# EAGLE design Breakout_05_08 (EAGLE 9.6.2)
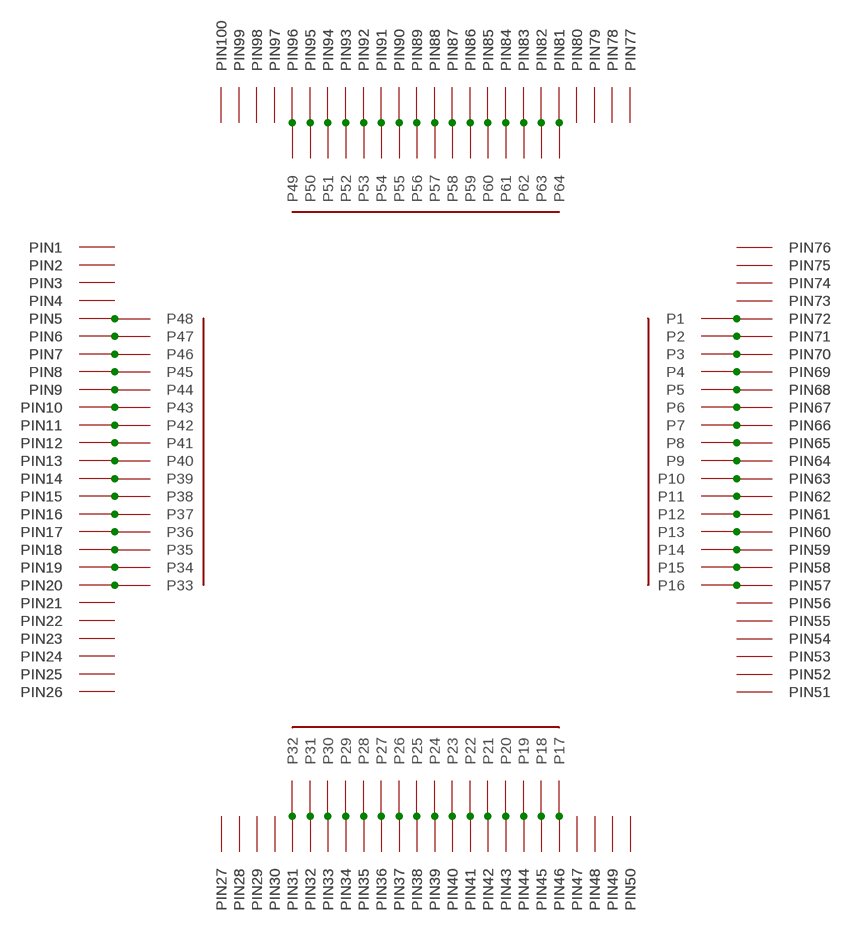
[diagram p0: schematic, sheet 1]

## Parts
U$1  OUTTER_PADS_100PIN  [TQFP_100_PIN_DIN]
U$2  SMT_64PIN_R  [TQFP_SMT_08MM]
U$3  SMT_100PIN  [TQFP_SMT_05MM]

## Nets
N$1: U$1.P$157(PIN57) U$2.P$16(P16) U$3.P$57(PIN57)
N$2: U$1.P$158(PIN58) U$2.P$15(P15) U$3.P$58(PIN58)
N$3: U$1.P$159(PIN59) U$2.P$14(P14) U$3.P$59(PIN59)
N$4: U$1.P$160(PIN60) U$2.P$13(P13) U$3.P$60(PIN60)
N$5: U$1.P$161(PIN61) U$2.P$12(P12) U$3.P$61(PIN61)
N$6: U$1.P$162(PIN62) U$2.P$11(P11) U$3.P$62(PIN62)
N$7: U$1.P$163(PIN63) U$2.P$10(P10) U$3.P$63(PIN63)
N$8: U$1.P$164(PIN64) U$2.P$9(P9) U$3.P$64(PIN64)
N$9: U$1.P$165(PIN65) U$2.P$8(P8) U$3.P$65(PIN65)
N$10: U$1.P$166(PIN66) U$2.P$7(P7) U$3.P$66(PIN66)
N$11: U$1.P$167(PIN67) U$2.P$6(P6) U$3.P$67(PIN67)
N$12: U$1.P$168(PIN68) U$2.P$5(P5) U$3.P$68(PIN68)
N$13: U$1.P$169(PIN69) U$2.P$4(P4) U$3.P$69(PIN69)
N$14: U$1.P$170(PIN70) U$2.P$3(P3) U$3.P$70(PIN70)
N$15: U$1.P$171(PIN71) U$2.P$2(P2) U$3.P$71(PIN71)
N$16: U$1.P$172(PIN72) U$2.P$1(P1) U$3.P$72(PIN72)
N$17: U$1.P$146(PIN46) U$2.P$17(P17) U$3.P$46(PIN46)
N$18: U$1.P$145(PIN45) U$2.P$18(P18) U$3.P$45(PIN45)
N$19: U$1.P$144(PIN44) U$2.P$19(P19) U$3.P$44(PIN44)
N$20: U$1.P$143(PIN43) U$2.P$20(P20) U$3.P$43(PIN43)
N$21: U$1.P$142(PIN42) U$2.P$21(P21) U$3.P$42(PIN42)
N$22: U$1.P$141(PIN41) U$2.P$22(P22) U$3.P$41(PIN41)
N$23: U$1.P$140(PIN40) U$2.P$23(P23) U$3.P$40(PIN40)
N$24: U$1.P$139(PIN39) U$2.P$24(P24) U$3.P$39(PIN39)
N$25: U$1.P$138(PIN38) U$2.P$25(P25) U$3.P$38(PIN38)
N$26: U$1.P$137(PIN37) U$2.P$27(P26) U$3.P$37(PIN37)
N$27: U$1.P$136(PIN36) U$2.P$28(P27) U$3.P$36(PIN36)
N$28: U$1.P$135(PIN35) U$2.P$29(P28) U$3.P$35(PIN35)
N$29: U$1.P$134(PIN34) U$2.P$30(P29) U$3.P$34(PIN34)
N$30: U$1.P$133(PIN33) U$2.P$31(P30) U$3.P$33(PIN33)
N$31: U$1.P$132(PIN32) U$2.P$32(P31) U$3.P$32(PIN32)
N$32: U$1.P$131(PIN31) U$2.P$33(P32) U$3.P$31(PIN31)
N$33: U$1.P$120(PIN20) U$2.P$34(P33) U$3.P$20(PIN20)
N$34: U$1.P$119(PIN19) U$2.P$35(P34) U$3.P$19(PIN19)
N$35: U$1.P$118(PIN18) U$2.P$36(P35) U$3.P$18(PIN18)
N$36: U$1.P$117(PIN17) U$2.P$37(P36) U$3.P$17(PIN17)
N$37: U$1.P$116(PIN16) U$2.P$38(P37) U$3.P$16(PIN16)
N$38: U$1.P$115(PIN15) U$2.P$39(P38) U$3.P$15(PIN15)
N$39: U$1.P$114(PIN14) U$2.P$40(P39) U$3.P$14(PIN14)
N$40: U$1.P$113(PIN13) U$2.P$41(P40) U$3.P$13(PIN13)
N$41: U$1.P$112(PIN12) U$2.P$42(P41) U$3.P$12(PIN12)
N$42: U$1.P$111(PIN11) U$2.P$43(P42) U$3.P$11(PIN11)
N$43: U$1.P$110(PIN10) U$2.P$44(P43) U$3.P$10(PIN10)
N$44: U$1.P$109(PIN9) U$2.P$45(P44) U$3.P$9(PIN9)
N$45: U$1.P$108(PIN8) U$2.P$46(P45) U$3.P$8(PIN8)
N$46: U$1.P$107(PIN7) U$2.P$47(P46) U$3.P$7(PIN7)
N$47: U$1.P$106(PIN6) U$2.P$48(P47) U$3.P$6(PIN6)
N$48: U$1.P$105(PIN5) U$2.P$49(P48) U$3.P$5(PIN5)
N$49: U$1.P$196(PIN96) U$2.P$50(P49) U$3.P$96(PIN96)
N$50: U$1.P$195(PIN95) U$2.P$51(P50) U$3.P$95(PIN95)
N$51: U$1.P$194(PIN94) U$2.P$52(P51) U$3.P$94(PIN94)
N$52: U$1.P$193(PIN93) U$2.P$53(P52) U$3.P$93(PIN93)
N$53: U$1.P$192(PIN92) U$2.P$54(P53) U$3.P$92(PIN92)
N$54: U$1.P$191(PIN91) U$2.P$55(P54) U$3.P$91(PIN91)
N$55: U$1.P$190(PIN90) U$2.P$56(P55) U$3.P$90(PIN90)
N$56: U$1.P$189(PIN89) U$2.P$57(P56) U$3.P$89(PIN89)
N$57: U$1.P$188(PIN88) U$2.P$58(P57) U$3.P$88(PIN88)
N$58: U$1.P$187(PIN87) U$2.P$59(P58) U$3.P$87(PIN87)
N$59: U$1.P$186(PIN86) U$2.P$60(P59) U$3.P$86(PIN86)
N$60: U$1.P$185(PIN85) U$2.P$61(P60) U$3.P$85(PIN85)
N$61: U$1.P$184(PIN84) U$2.P$62(P61) U$3.P$84(PIN84)
N$62: U$1.P$183(PIN83) U$2.P$63(P62) U$3.P$83(PIN83)
N$63: U$1.P$182(PIN82) U$2.P$64(P63) U$3.P$82(PIN82)
N$64: U$1.P$181(PIN81) U$2.P$65(P64) U$3.P$81(PIN81)
N$65: U$1.P$101(PIN1) U$3.P$1(PIN1)
N$66: U$1.P$102(PIN2) U$3.P$2(PIN2)
N$67: U$1.P$103(PIN3) U$3.P$3(PIN3)
N$68: U$1.P$104(PIN4) U$3.P$4(PIN4)
N$69: U$1.P$121(PIN21) U$3.P$21(PIN21)
N$70: U$1.P$122(PIN22) U$3.P$22(PIN22)
N$71: U$1.P$123(PIN23) U$3.P$23(PIN23)
N$72: U$1.P$124(PIN24) U$3.P$24(PIN24)
N$73: U$1.P$125(PIN25) U$3.P$25(PIN25)
N$74: U$1.P$126(PIN26) U$3.P$26(PIN26)
N$75: U$1.P$127(PIN27) U$3.P$27(PIN27)
N$76: U$1.P$128(PIN28) U$3.P$28(PIN28)
N$77: U$1.P$129(PIN29) U$3.P$29(PIN29)
N$78: U$1.P$130(PIN30) U$3.P$30(PIN30)
N$79: U$1.P$147(PIN47) U$3.P$47(PIN47)
N$80: U$1.P$148(PIN48) U$3.P$48(PIN48)
N$81: U$1.P$149(PIN49) U$3.P$49(PIN49)
N$82: U$1.P$150(PIN50) U$3.P$50(PIN50)
N$83: U$1.P$151(PIN51) U$3.P$51(PIN51)
N$84: U$1.P$152(PIN52) U$3.P$52(PIN52)
N$85: U$1.P$153(PIN53) U$3.P$53(PIN53)
N$86: U$1.P$154(PIN54) U$3.P$54(PIN54)
N$87: U$1.P$155(PIN55) U$3.P$55(PIN55)
N$88: U$1.P$156(PIN56) U$3.P$56(PIN56)
N$89: U$1.P$173(PIN73) U$3.P$73(PIN73)
N$90: U$1.P$174(PIN74) U$3.P$74(PIN74)
N$91: U$1.P$175(PIN75) U$3.P$75(PIN75)
N$92: U$1.P$176(PIN76) U$3.P$76(PIN76)
N$93: U$1.P$177(PIN77) U$3.P$77(PIN77)
N$94: U$1.P$178(PIN78) U$3.P$78(PIN78)
N$95: U$1.P$179(PIN79) U$3.P$79(PIN79)
N$96: U$1.P$180(PIN80) U$3.P$80(PIN80)
N$97: U$1.P$197(PIN97) U$3.P$97(PIN97)
N$98: U$1.P$198(PIN98) U$3.P$98(PIN98)
N$99: U$1.P$199(PIN99) U$3.P$99(PIN99)
N$100: U$1.P$200(PIN100) U$3.P$100(PIN100)

## Library data of the parts
U$1 = Breakout_Boards:OUTTER_PADS_100PIN
U$2 = Breakout_Boards:SMT_64PIN_R
U$3 = Breakout_Boards:SMT_100PIN

## Board
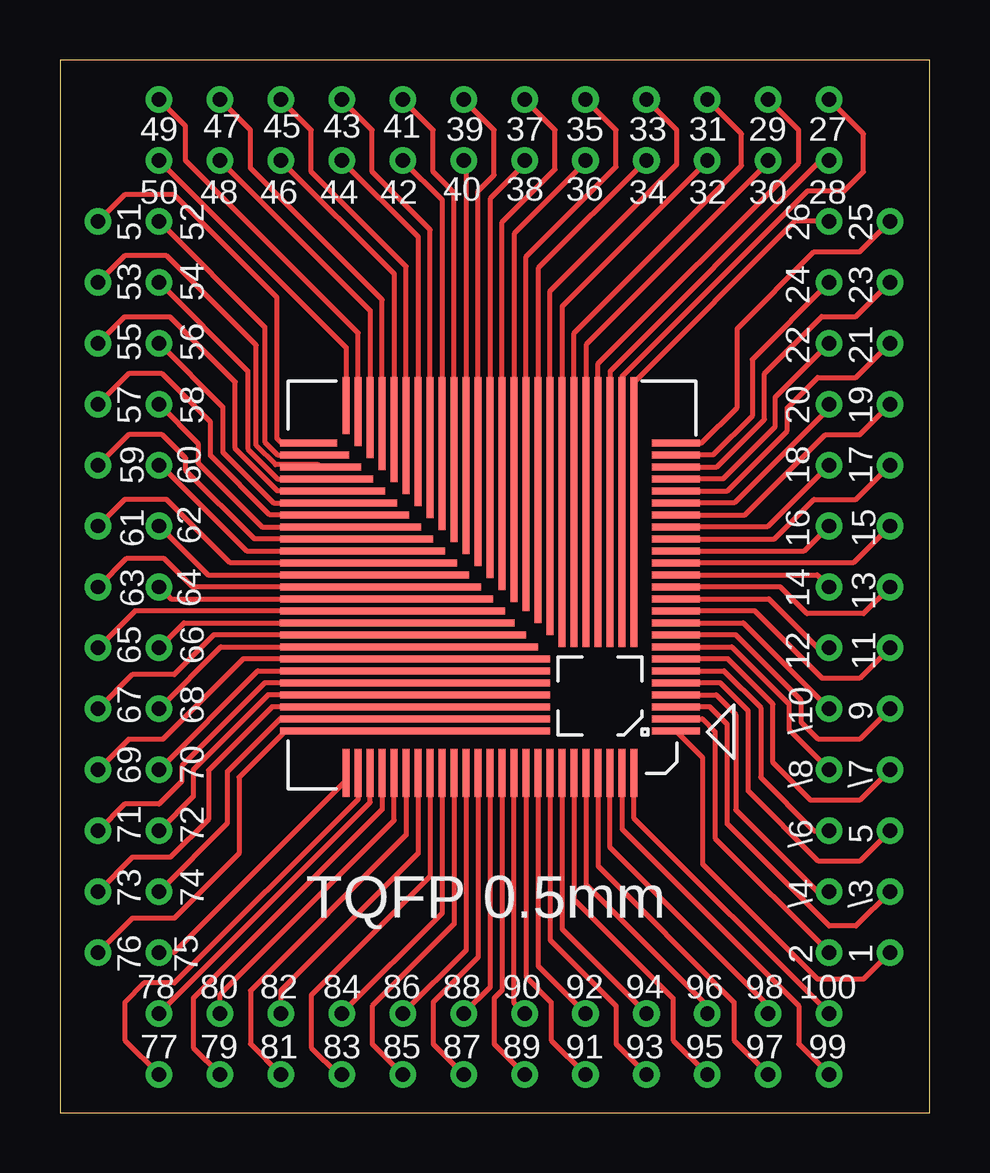
[diagram p1: board, top side]
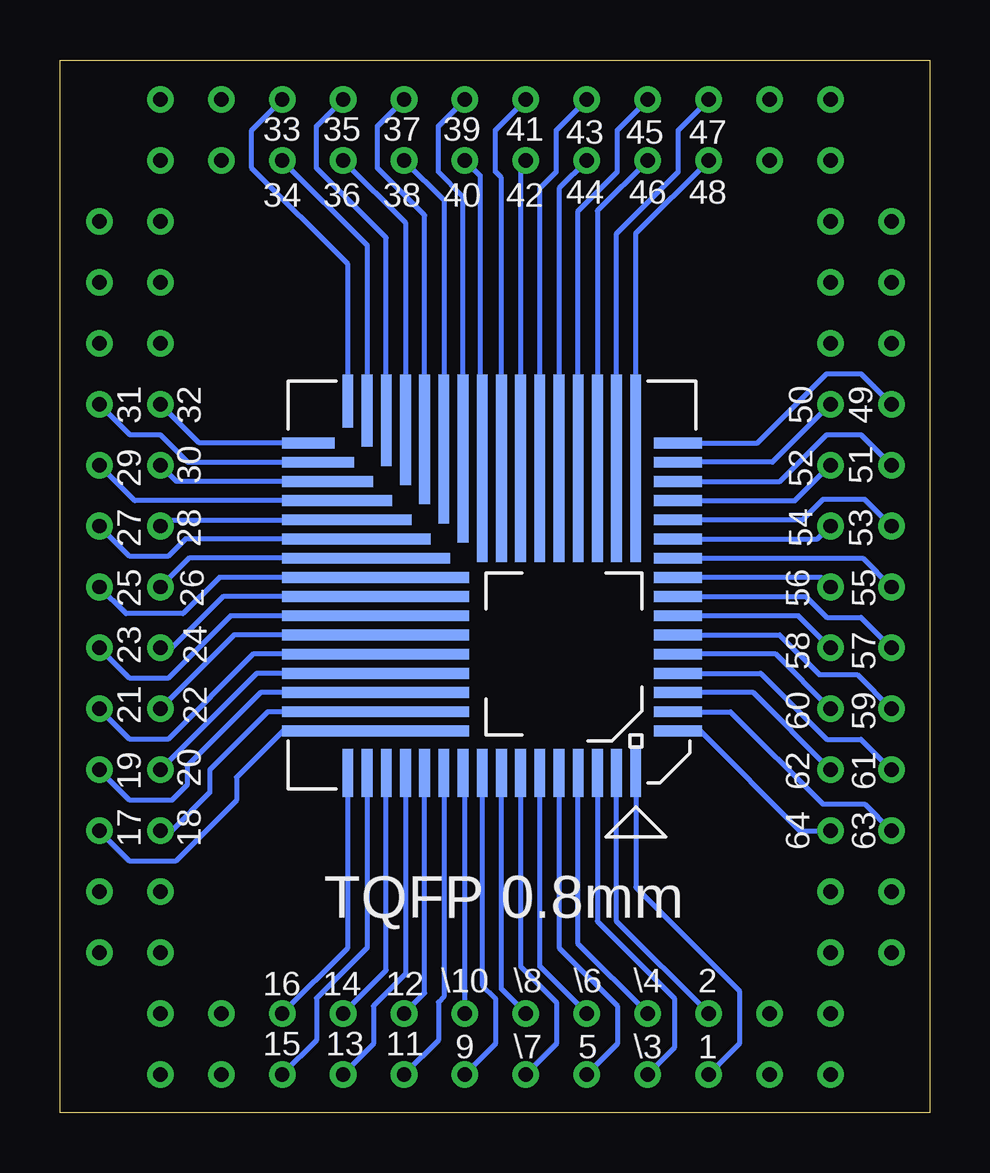
[diagram p2: board, bottom side, seen from below]

Size 36.25 x 43.88 mm. Coordinates in mm from the lower left corner, seen from the top.
Outline: 0,0 36.25,0 36.25,43.88 0,43.88 0,0
Copper layers (1*16): Top 0.035mm / dielectric 1.5mm / Bottom 0.035mm
Design rules "default": minimum track width 6mil, minimum drill 0.35mm, track to track 6mil, track to pad 6mil, pad to pad 6mil, via to via 6mil, smd to smd 6mil, copper to edge 40mil, drill to drill 6mil, minimum pad ring 10mil, minimum via ring 8mil, stop-mask expansion 4mil, vias tented up to drill 0mil, thermal gap 10mil

### Footprints (pad centres in the part's own frame; a part is rotated, then mirrored left to right if it is on the bottom)
TQFP_100_PIN_DIN = drill 0.6: P$101 -16.51,15.24; P$102 -13.97,15.24; P$103 -16.51,12.7; P$104 -13.97,12.7; P$105 -16.51,10.16; P$106 -13.97,10.16; P$107 -16.51,7.62; P$108 -13.97,7.62; P$109 -16.51,5.08; P$110 -13.97,5.08; P$111 -16.51,2.54; P$112 -13.97,2.54; P$113 -16.51,0; P$114 -13.97,0; P$115 -16.51,-2.54; P$116 -13.97,-2.54; P$117 -16.51,-5.08; P$118 -13.97,-5.08; P$119 -16.51,-7.62; P$120 -13.97,-7.62; P$121 -16.51,-10.16; P$122 -13.97,-10.16; P$123 -16.51,-12.7; P$124 -13.97,-12.7; P$125 -16.51,-15.24; P$126 -13.97,-15.24; P$127 -13.97,-20.32; P$128 -13.97,-17.78; P$129 -11.43,-20.32; P$130 -11.43,-17.78; P$131 -8.89,-20.32; P$132 -8.89,-17.78; P$133 -6.35,-20.32; P$134 -6.35,-17.78; P$135 -3.81,-20.32; P$136 -3.81,-17.78; P$137 -1.27,-20.32; P$138 -1.27,-17.78; P$139 1.27,-20.32; P$140 1.27,-17.78; P$141 3.81,-20.32; P$142 3.81,-17.78; P$143 6.35,-20.32; P$144 6.35,-17.78; P$145 8.89,-20.32; P$146 8.89,-17.78; P$147 11.43,-20.32; P$148 11.43,-17.78; P$149 13.97,-20.32; P$150 13.97,-17.78; P$151 16.51,-15.24; P$152 13.97,-15.24; P$153 16.51,-12.7; P$154 13.97,-12.7; P$155 16.51,-10.16; P$156 13.97,-10.16; P$157 16.51,-7.62; P$158 13.97,-7.62; P$159 16.51,-5.08; P$160 13.97,-5.08; P$161 16.51,-2.54; P$162 13.97,-2.54; P$163 16.51,0; P$164 13.97,0; P$165 16.51,2.54; P$166 13.97,2.54; P$167 16.51,5.08; P$168 13.97,5.08; P$169 16.51,7.62; P$170 13.97,7.62; P$171 16.51,10.16; P$172 13.97,10.16; P$173 16.51,12.7; P$174 13.97,12.7; P$175 16.51,15.24; P$176 13.97,15.24; P$177 13.97,20.32; P$178 13.97,17.78; P$179 11.43,20.32; P$180 11.43,17.78; P$181 8.89,20.32; P$182 8.89,17.78; P$183 6.35,20.32; P$184 6.35,17.78; P$185 3.81,20.32; P$186 3.81,17.78; P$187 1.27,20.32; P$188 1.27,17.78; P$189 -1.27,20.32; P$190 -1.27,17.78; P$191 -3.81,20.32; P$192 -3.81,17.78; P$193 -6.35,20.32; P$194 -6.35,17.78; P$195 -8.89,20.32; P$196 -8.89,17.78; P$197 -11.43,20.32; P$198 -11.43,17.78; P$199 -13.97,20.32; P$200 -13.97,17.78
TQFP_SMT_08MM = smd 2 x 0.45: P$1 -7.6,6; P$2 -7.6,5.2; P$3 -7.6,4.4; P$4 -7.6,3.6; P$5 -7.6,2.8; P$6 -7.6,2; P$7 -7.6,1.2; P$8 -7.6,0.4; P$9 -7.6,-0.4; P$10 -7.6,-1.2; P$11 -7.6,-2; P$12 -7.6,-2.8; P$13 -7.6,-3.6; P$14 -7.6,-4.4; P$15 -7.6,-5.2; P$16 -7.6,-6 | smd 0.45 x 7.8: P$17 -5.85,-4.95; P$18 -5.05,-4.95; P$19 -4.25,-4.95; P$20 -3.45,-4.95; P$21 -2.65,-4.95; P$22 -1.85,-4.95; P$23 -1.05,-4.95; P$24 -0.25,-4.95; P$25 0.55,-4.95 | smd 0.45 x 7: P$27 1.35,-5.35 | smd 0.45 x 6.2: P$28 2.15,-5.75 | smd 0.45 x 5.4: P$29 2.95,-6.15 | smd 0.45 x 4.6: P$30 3.75,-6.55 | smd 0.45 x 3.8: P$31 4.55,-6.95 | smd 0.45 x 3: P$32 5.35,-7.35 | smd 0.45 x 2.2: P$33 6.15,-7.75 | smd 2.2 x 0.45: P$34 7.8,-6 | smd 3 x 0.45: P$35 7.4,-5.2 | smd 3.8 x 0.45: P$36 7,-4.4 | smd 4.6 x 0.45: P$37 6.6,-3.6 | smd 5.4 x 0.45: P$38 6.2,-2.8 | smd 6.2 x 0.45: P$39 5.8,-2 | smd 7 x 0.45: P$40 5.4,-1.2 | smd 7.8 x 0.45: P$41 5,-0.4; P$42 5,0.4; P$43 5,1.2; P$44 5,2; P$45 5,2.8; P$46 5,3.6; P$47 5,4.4; P$48 5,5.2; P$49 5,6 | smd 0.45 x 2: P$50 6.15,7.75; P$51 5.35,7.75; P$52 4.55,7.75; P$53 3.75,7.75; P$54 2.95,7.75; P$55 2.15,7.75; P$56 1.35,7.75; P$57 0.55,7.75; P$58 -0.25,7.75; P$59 -1.05,7.75; P$60 -1.85,7.75; P$61 -2.65,7.75; P$62 -3.45,7.75; P$63 -4.25,7.75; P$64 -5.05,7.75; P$65 -5.85,7.75
TQFP_SMT_05MM = smd 2 x 0.3: P$1 -7.58,6; P$2 -7.58,5.5; P$3 -7.58,5; P$4 -7.58,4.5; P$5 -7.58,4; P$6 -7.58,3.5; P$7 -7.58,3; P$8 -7.58,2.5; P$9 -7.58,2; P$10 -7.58,1.5; P$11 -7.58,1; P$12 -7.58,0.5; P$13 -7.58,0; P$14 -7.58,-0.5; P$15 -7.58,-1; P$16 -7.58,-1.5; P$17 -7.58,-2; P$18 -7.58,-2.5; P$19 -7.58,-3; P$20 -7.58,-3.5; P$21 -7.58,-4; P$22 -7.58,-4.5; P$23 -7.58,-5; P$24 -7.58,-5.5; P$25 -7.58,-6 | smd 0.3 x 11.25: P$26 -5.83,-3.125; P$27 -5.33,-3.125; P$28 -4.83,-3.125; P$29 -4.33,-3.125; P$30 -3.83,-3.125; P$31 -3.33,-3.125; P$32 -2.83,-3.125 | smd 0.3 x 10.75: P$33 -2.33,-3.375 | smd 0.3 x 10.25: P$34 -1.83,-3.625 | smd 0.3 x 9.75: P$35 -1.33,-3.875 | smd 0.3 x 9.375: P$36 -0.83,-4.062 | smd 0.3 x 8.875: P$37 -0.33,-4.312 | smd 0.3 x 8.375: P$38 0.17,-4.562 | smd 0.3 x 7.875: P$39 0.67,-4.812 | smd 0.3 x 7.375: P$40 1.17,-5.062 | smd 0.3 x 6.875: P$41 1.67,-5.312 | smd 0.3 x 6.375: P$42 2.17,-5.562 | smd 0.3 x 5.875: P$43 2.67,-5.812 | smd 0.3 x 5.375: P$44 3.17,-6.062 | smd 0.3 x 4.875: P$45 3.67,-6.312 | smd 0.3 x 4.375: P$46 4.17,-6.562 | smd 0.3 x 3.875: P$47 4.67,-6.812 | smd 0.3 x 3.375: P$48 5.17,-7.062 | smd 0.3 x 2.875: P$49 5.67,-7.312 | smd 0.3 x 2.375: P$50 6.17,-7.562 | smd 2.375 x 0.3: P$51 7.732,-6 | smd 2.875 x 0.3: P$52 7.482,-5.5 | smd 3.375 x 0.3: P$53 7.232,-5 | smd 3.875 x 0.3: P$54 6.982,-4.5 | smd 4.375 x 0.3: P$55 6.732,-4 | smd 4.875 x 0.3: P$56 6.482,-3.5 | smd 5.375 x 0.3: P$57 6.232,-3 | smd 5.875 x 0.3: P$58 5.982,-2.5 | smd 6.375 x 0.3: P$59 5.732,-2 | smd 6.875 x 0.3: P$60 5.482,-1.5 | smd 7.375 x 0.3: P$61 5.232,-1 | smd 7.875 x 0.3: P$62 4.982,-0.5 | smd 8.375 x 0.3: P$63 4.732,0 | smd 8.875 x 0.3: P$64 4.482,0.5 | smd 9.375 x 0.3: P$65 4.232,1 | smd 9.78 x 0.3: P$66 4.045,1.5 | smd 10.25 x 0.3: P$67 3.795,2 | smd 10.75 x 0.3: P$68 3.545,2.5 | smd 11.25 x 0.3: P$69 3.295,3; P$70 3.295,3.5; P$71 3.295,4; P$72 3.295,4.5; P$73 3.295,5; P$74 3.295,5.5; P$75 3.295,6 | smd 0.3 x 2: P$76 6.17,7.75; P$77 5.67,7.75; P$78 5.17,7.75; P$79 4.67,7.75; P$80 4.17,7.75; P$81 3.67,7.75; P$82 3.17,7.75; P$83 2.67,7.75; P$84 2.17,7.75; P$85 1.67,7.75; P$86 1.17,7.75; P$87 0.67,7.75; P$88 0.17,7.75; P$89 -0.33,7.75; P$90 -0.83,7.75; P$91 -1.33,7.75; P$92 -1.83,7.75; P$93 -2.33,7.75; P$94 -2.83,7.75; P$95 -3.33,7.75; P$96 -3.83,7.75; P$97 -4.33,7.75; P$98 -4.83,7.75; P$99 -5.33,7.75; P$100 -5.83,7.75

### Placement (x,y rotation side)
U$1  18.1,21.91 180 top
U$2  18.1,21.91 180 bottom
U$3  18.1,21.91 180 top

### Tracks (layer width: path | path; a pad name or v marks a point on that pad's centre or on a via)
N$1
  Top 0.203: U$3.P$57 8.75,24.91 6.27,27.38 6.27,28.78 4.26,30.8 2.86,30.8 U$1.P$157
  Bottom 0.203: U$2.P$16 7.18,27.91 4.29,30.8 2.86,30.8 U$1.P$157
N$2
  Top 0.203: U$1.P$158 5.76,27.9 5.76,27.07 8.43,24.41 U$3.P$58
  Bottom 0.203: U$1.P$158 6.55,27.11 U$2.P$15
N$3
  Top 0.203: U$3.P$59 8.11,23.91 5.25,26.77 5.25,27.27 4.26,28.26 2.86,28.26 U$1.P$159
  Bottom 0.203: U$2.P$14 6.24,26.31 4.29,28.26 2.86,28.26 U$1.P$159
N$4
  Top 0.203: U$1.P$160 4.21,26.99 7.79,23.41 U$3.P$60
  Bottom 0.203: U$2.P$13 5.61,25.51 U$1.P$160
N$5
  Top 0.203: U$3.P$61 7.1,22.91 4.45,25.56 2.7,25.56 U$1.P$161
  Bottom 0.203: U$1.P$161 2.7,25.56 4.45,25.56 5.3,24.71 U$2.P$12
N$6
  Top 0.203: U$3.P$62 6.17,22.41 U$1.P$162
  Bottom 0.203: U$2.P$11 4.67,23.91 U$1.P$162
N$7
  Top 0.203: U$3.P$63 5.53,21.91 4.35,23.09 2.77,23.09 U$1.P$163
  Bottom 0.203: U$2.P$10 2.79,23.11 U$1.P$163
N$8
  Top 0.203: U$3.P$64 4.63,21.41 U$1.P$164
  Bottom 0.203: U$1.P$164 4.53,22.31 U$2.P$9
N$9
  Top 0.203: U$3.P$65 3.13,20.91 U$1.P$165
  Bottom 0.203: U$2.P$8 5.16,21.51 4.29,20.64 2.86,20.64 U$1.P$165
N$10
  Top 0.203: U$1.P$166 5.17,20.41 U$3.P$66
  Bottom 0.203: U$1.P$166 5.47,20.71 U$2.P$7
N$11
  Top 0.203: U$3.P$67 6.41,19.91 4.76,18.26 3.02,18.26 U$1.P$167
  Bottom 0.203: U$2.P$6 6.25,19.91 4.6,18.26 3.02,18.26 U$1.P$167
N$12
  Top 0.203: U$1.P$168 6.71,19.41 U$3.P$68
  Bottom 0.203: U$1.P$168 6.41,19.11 U$2.P$5
N$13
  Top 0.203: U$3.P$69 7.64,18.91 4.29,15.56 2.86,15.56 U$1.P$169
  Bottom 0.203: U$2.P$4 7.04,18.31 4.29,15.56 2.86,15.56 U$1.P$169
N$14
  Top 0.203: U$1.P$170 8.25,18.41 U$3.P$70
  Bottom 0.203: U$1.P$170 7.35,17.51 U$2.P$3
N$15
  Top 0.203: U$3.P$71 8.54,17.91 5.08,14.45 5.08,13.81 4.13,12.86 2.7,12.86 U$1.P$171
  Bottom 0.203: U$2.P$2 8.29,16.71 4.45,12.86 2.7,12.86 U$1.P$171
N$16
  Top 0.203: U$3.P$72 8.68,17.41 5.56,14.29 5.56,13.18 U$1.P$172
  Bottom 0.203: U$2.P$1 9.56,15.91 5.4,11.75 U$1.P$172
N$17
  Top 0.203: U$1.P$146 13.93,34.97 U$3.P$46
  Bottom 0.203: U$2.P$17 12.25,36.65 U$1.P$146
N$18
  Top 0.203: U$3.P$45 14.43,35.26 10.48,39.21 10.48,40.96 U$1.P$145
  Bottom 0.203: U$2.P$18 13.05,36.64 10.48,39.21 10.48,40.96 U$1.P$145
N$19
  Top 0.203: U$1.P$144 14.93,36.51 U$3.P$44
  Bottom 0.203: U$1.P$144 13.85,37.59 U$2.P$19
N$20
  Top 0.203: U$3.P$43 15.43,36.8 13.02,39.21 13.02,40.96 U$1.P$143
  Bottom 0.203: U$2.P$20 14.65,37.58 13.02,39.21 13.02,40.96 U$1.P$143
N$21
  Top 0.203: U$1.P$142 15.93,38.05 U$3.P$42
  Bottom 0.203: U$1.P$142 15.45,38.53 U$2.P$21
N$22
  Top 0.203: U$3.P$41 16.43,38.34 15.56,39.21 15.56,40.96 U$1.P$141
  Bottom 0.203: U$2.P$22 16.25,38.52 15.56,39.21 15.56,40.96 U$1.P$141
N$23
  Top 0.203: U$1.P$140 16.93,39.59 U$3.P$40
  Bottom 0.203: U$1.P$140 17.05,39.47 U$2.P$23
N$24
  Top 0.203: U$3.P$39 17.43,38.41 18.1,39.08 18.1,40.96 U$1.P$139
  Bottom 0.203: U$2.P$24 17.85,38.96 18.1,39.21 18.1,40.96 U$1.P$139
N$25
  Top 0.203: U$1.P$138 19.37,39.53 17.93,38.09 U$3.P$38
  Bottom 0.203: U$1.P$138 18.73,39.05 18.73,26.35 18.65,26.44 U$2.P$25
N$26
  Top 0.203: U$3.P$37 18.43,37.11 20.64,39.32 20.64,40.96 U$1.P$137
  Bottom 0.203: U$2.P$27 19.45,38.18 20.48,39.21 20.48,41.12 U$1.P$137
N$27
  Top 0.203: U$1.P$136 21.91,39.61 18.93,36.63 U$3.P$36
  Bottom 0.203: U$1.P$136 20.25,38.03 U$2.P$28
N$28
  Top 0.203: U$3.P$35 19.43,35.67 23.18,39.42 23.18,40.96 U$1.P$135
  Bottom 0.203: U$2.P$29 21.05,37.4 23.02,39.37 23.02,41.12 U$1.P$135
N$29
  Top 0.203: U$3.P$34 19.93,35.2 24.42,39.69 U$1.P$134
  Bottom 0.203: U$1.P$134 21.85,37.09 U$2.P$30
N$30
  Top 0.203: U$3.P$33 20.43,34.24 25.72,39.53 25.72,40.96 U$1.P$133
  Bottom 0.203: U$2.P$31 22.65,36.46 25.56,39.37 25.56,41.12 U$1.P$133
N$31
  Top 0.203: U$1.P$132 26.99,39.66 20.93,33.6 U$3.P$32
  Bottom 0.203: U$1.P$132 23.45,36.15 U$2.P$32
N$32
  Top 0.203: U$3.P$31 21.43,32.49 28.42,39.48 28.42,40.8 U$1.P$131
  Bottom 0.203: U$2.P$33 24.25,35.36 28.26,39.37 28.26,40.96 U$1.P$131
N$33
  Top 0.203: U$1.P$120 32.07,29.37 28.11,25.41 U$3.P$20
  Bottom 0.203: U$2.P$34 30.45,27.91 U$1.P$120
N$34
  Top 0.203: U$3.P$19 28.56,24.91 31.91,28.26 33.34,28.26 U$1.P$119
  Bottom 0.203: U$1.P$119 33.34,28.26 32.07,28.26 30.92,27.11 U$2.P$35
N$35
  Top 0.203: U$1.P$118 29.49,24.41 U$3.P$18
  Bottom 0.203: U$2.P$36 31.39,26.31 U$1.P$118
N$36
  Top 0.203: U$3.P$17 29.78,23.91 31.43,25.56 33.18,25.56 U$1.P$117
  Bottom 0.203: U$2.P$37 33.13,25.51 U$1.P$117
N$37
  Top 0.203: U$3.P$16 31.03,23.41 U$1.P$116
  Bottom 0.203: U$1.P$116 31.81,24.71 U$2.P$38
N$38
  Top 0.203: U$1.P$115 33.07,22.91 U$3.P$15
  Bottom 0.203: U$2.P$39 31.02,23.91 31.75,23.18 33.34,23.18 U$1.P$115
N$39
  Top 0.203: U$3.P$14 31.57,22.41 U$1.P$114
  Bottom 0.203: U$2.P$40 30.87,23.11 U$1.P$114
N$40
  Top 0.203: U$1.P$113 33.5,20.8 31.14,20.8 30.03,21.91 U$3.P$13
  Bottom 0.203: U$2.P$41 29.6,22.31 31.11,20.8 33.5,20.8 U$1.P$113
N$41
  Top 0.203: U$3.P$12 29.55,21.41 31.59,19.37 U$1.P$112
  Bottom 0.203: U$2.P$42 29.45,21.51 31.59,19.37 U$1.P$112
N$42
  Top 0.203: U$1.P$111 33.34,18.1 31.78,18.1 28.97,20.91 U$3.P$11
  Bottom 0.203: U$2.P$43 29.14,20.71 31.75,18.1 33.34,18.1 U$1.P$111
N$43
  Top 0.203: U$3.P$10 28.49,20.41 U$1.P$110
  Bottom 0.203: U$2.P$44 28.99,19.91 U$1.P$110
N$44
  Top 0.203: U$1.P$109 33.34,15.56 31.62,15.56 30.91,16.27 30.91,17.17 28.17,19.91 U$3.P$9
  Bottom 0.203: U$2.P$45 28.2,19.11 31.75,15.56 33.34,15.56 U$1.P$109
N$45
  Top 0.203: U$1.P$108 30.39,15.96 30.39,17.02 28.01,19.41 U$3.P$8
  Bottom 0.203: U$2.P$46 28.05,18.31 U$1.P$108
N$46
  Top 0.203: U$1.P$107 33.34,13.02 31.3,13.02 29.72,14.59 29.72,17.03 27.84,18.91 U$3.P$7
  Bottom 0.203: U$2.P$47 27.89,17.51 30.96,14.45 30.96,13.65 31.59,13.02 33.34,13.02 U$1.P$107
N$47
  Top 0.203: U$3.P$6 27.68,18.41 29.21,16.88 29.21,13.97 31.43,11.75 U$1.P$106
  Bottom 0.203: U$2.P$48 27.58,16.71 30,14.29 30,13.34 31.59,11.75 U$1.P$106
N$48
  Top 0.203: U$1.P$105 33.34,10.48 31.62,10.48 28.69,13.41 28.69,16.74 27.52,17.91 U$3.P$5
  Bottom 0.203: U$2.P$49 26.95,15.91 28.89,13.97 28.89,13.02 31.43,10.48 33.34,10.48 U$1.P$105
N$49
  Top 0.203: U$3.P$96 21.93,9.51 26.99,4.45 U$1.P$196
  Bottom 0.203: U$1.P$196 24.25,6.87 U$2.P$50
N$50
  Top 0.203: U$3.P$95 21.43,8.89 25.56,4.76 25.56,3.02 U$1.P$195
  Bottom 0.203: U$2.P$51 23.45,6.87 25.56,4.76 25.56,3.02 U$1.P$195
N$51
  Top 0.203: U$3.P$94 20.93,7.65 U$1.P$194
  Bottom 0.203: U$1.P$194 22.65,5.93 U$2.P$52
N$52
  Top 0.203: U$3.P$93 20.43,7.2 23.18,4.45 23.18,2.86 U$1.P$193
  Bottom 0.203: U$2.P$53 21.85,5.78 23.18,4.45 23.18,2.86 U$1.P$193
N$53
  Top 0.203: U$3.P$92 19.93,6.11 U$1.P$192
  Bottom 0.203: U$1.P$192 21.05,4.99 U$2.P$54
N$54
  Top 0.203: U$3.P$91 19.43,5.66 20.48,4.6 20.48,3.02 U$1.P$191
  Bottom 0.203: U$2.P$55 20.25,4.83 20.48,4.6 20.48,3.02 U$1.P$191
N$55
  Top 0.203: U$1.P$190 18.93,4.57 U$3.P$90
  Bottom 0.203: U$1.P$190 19.37,14.08 U$2.P$56
N$56
  Top 0.203: U$3.P$89 18.43,5.09 18.1,4.76 18.1,2.86 U$1.P$189
  Bottom 0.203: U$2.P$57 18.65,5.31 18.1,4.76 18.1,2.86 U$1.P$189
N$57
  Top 0.203: U$3.P$88 17.93,5.23 U$1.P$188
  Bottom 0.203: U$1.P$188 17.85,5.15 U$2.P$58
N$58
  Top 0.203: U$3.P$87 17.43,6.47 15.56,4.6 15.56,2.86 U$1.P$187
  Bottom 0.203: U$2.P$59 17.05,6.09 15.56,4.6 15.56,2.86 U$1.P$187
N$59
  Top 0.203: U$3.P$86 16.93,6.77 U$1.P$186
  Bottom 0.203: U$1.P$186 16.25,6.09 U$2.P$60
N$60
  Top 0.203: U$3.P$85 16.43,7.86 13.02,4.45 13.02,2.86 U$1.P$185
  Bottom 0.203: U$2.P$61 15.45,6.88 13.02,4.45 13.02,2.86 U$1.P$185
N$61
  Top 0.203: U$3.P$84 15.93,8.31 U$1.P$184
  Bottom 0.203: U$1.P$184 14.65,7.03 U$2.P$62
N$62
  Top 0.203: U$3.P$83 15.43,9.85 10.48,4.89 10.48,2.7 11.59,1.59 U$1.P$183
  Bottom 0.203: U$2.P$63 13.85,7.97 10.64,4.76 10.64,2.7 U$1.P$183
N$63
  Top 0.203: U$3.P$82 14.93,10.8 9.21,5.08 U$1.P$182
  Bottom 0.203: U$1.P$182 13.05,7.97 U$2.P$64
N$64
  Top 0.203: U$3.P$81 14.43,11.57 7.94,5.08 7.94,2.86 U$1.P$181
  Bottom 0.203: U$2.P$65 12.25,9.39 7.94,5.08 7.94,2.86 U$1.P$181
N$65
  Top 0.203: U$3.P$1 26.79,14.8 26.79,10.36 31.58,5.57 33.51,5.57 U$1.P$101
N$66
  Top 0.203: U$3.P$2 26.77,16.41 27.3,15.88 27.3,11.43 U$1.P$102
N$67
  Top 0.203: U$1.P$103 33.18,7.78 32.07,7.78 27.82,12.03 27.82,16.18 27.09,16.91 U$3.P$3
N$68
  Top 0.203: U$3.P$4 27.36,17.41 28.18,16.59 28.18,12.62 31.59,9.21 U$1.P$104
N$69
  Top 0.203: U$3.P$21 27.81,25.91 30.32,28.42 30.32,29.37 31.59,30.64 33.18,30.64 U$1.P$121
N$70
  Top 0.203: U$1.P$122 29.81,29.81 29.81,28.57 27.64,26.41 U$3.P$22
N$71
  Top 0.203: U$3.P$23 27.38,26.91 29.37,28.89 29.37,30.8 31.75,33.18 33.18,33.18 U$1.P$123
N$72
  Top 0.203: U$1.P$124 28.85,31.39 28.85,29.04 27.22,27.41 U$3.P$24
N$73
  Top 0.203: U$3.P$25 26.74,27.91 28.23,29.39 28.23,32.68 31.43,35.88 33.34,35.88 U$1.P$125
N$74
  Top 0.203: U$1.P$126 30.64,37.15 23.93,30.44 U$3.P$26
N$75
  Top 0.203: U$3.P$27 23.43,30.67 31.17,38.42 32.7,38.42 33.5,39.21 33.5,40.8 U$1.P$127
N$76
  Top 0.203: U$1.P$128 31.95,39.57 31.6,39.57 22.93,30.89 U$3.P$28
N$77
  Top 0.203: U$3.P$29 22.43,31.21 30.8,39.58 30.8,40.96 U$1.P$129
N$78
  Top 0.203: U$1.P$130 29.53,39.61 21.93,32.01 U$3.P$30
N$79
  Top 0.203: U$3.P$47 13.43,33.88 7.94,39.37 7.94,40.96 U$1.P$147
N$80
  Top 0.203: U$1.P$148 12.93,33.43 U$3.P$48
N$81
  Top 0.203: U$3.P$49 12.43,32.5 5.24,39.69 5.24,41.12 U$1.P$149
N$82
  Top 0.203: U$1.P$150 11.93,31.89 U$3.P$50
N$83
  Top 0.203: U$3.P$51 9.24,27.91 9.05,28.1 9.05,33.97 4.76,38.26 2.7,38.26 U$1.P$151
N$84
  Top 0.203: U$1.P$152 8.53,32.74 8.53,27.95 9.08,27.41 U$3.P$52
N$85
  Top 0.203: U$3.P$53 10.77,27 8.98,27 8.18,27.8 8.18,31.98 4.45,35.72 2.7,35.72 U$1.P$153
N$86
  Top 0.203: U$1.P$154 7.82,30.91 7.82,27.66 9.07,26.41 U$3.P$54
N$87
  Top 0.203: U$3.P$55 9.07,25.91 7.3,27.68 7.3,30.45 4.59,33.16 2.69,33.16 U$1.P$155
N$88
  Top 0.203: U$1.P$156 6.79,29.41 6.79,27.53 8.91,25.41 U$3.P$56
N$89
  Top 0.203: U$3.P$73 14.42,16.91 8.84,16.91 6.19,14.26 6.19,12.22 4.6,10.64 3.02,10.64 U$1.P$173
N$90
  Top 0.203: U$1.P$174 6.99,12.06 6.99,14.22 9.17,16.41 U$3.P$74
N$91
  Top 0.203: U$3.P$75 9.4,15.91 7.46,13.97 7.46,10.79 4.76,8.1 3.02,8.1 U$1.P$175
N$92
  Top 0.203: U$3.P$76 11.93,13.84 4.75,6.67 U$1.P$176
N$93
  Top 0.203: U$3.P$77 12.43,13.06 4.76,5.4 3.49,5.4 2.7,4.6 2.7,3.02 U$1.P$177
N$94
  Top 0.203: U$1.P$178 12.93,12.93 U$3.P$78
N$95
  Top 0.203: U$3.P$79 13.43,12.63 5.56,4.76 5.56,2.7 U$1.P$179
N$96
  Top 0.203: U$1.P$180 6.67,4.92 13.93,12.18 U$3.P$80
N$97
  Top 0.203: U$3.P$97 22.43,10.28 28.1,4.6 28.1,3.02 U$1.P$197
N$98
  Top 0.203: U$1.P$198 29.53,4.45 22.93,11.04 U$3.P$98
N$99
  Top 0.203: U$3.P$99 23.43,11.81 30.8,4.45 30.8,2.86 U$1.P$199
N$100
  Top 0.203: U$1.P$200 23.93,12.27 U$3.P$100

### Text on the board
tPlace: 49 | 47 | 45 | 43 | 41 | 39 | 37 | 35 | 33 | 31 | 29 | 27 | 50 | 48 | 46 | 44 | 42 | 40 | 38 | 36 | 34 | 32 | 30 | 28 | 51 | 52 | 26 | 25 | 53 | 54 | 24 | 23 | 55 | 56 | 22 | 21 | 57 | 58 | 20 | 19 | 59 | 60 | 18 | 17 | 61 | 62 | 16 | 15 | 63 | 64 | 14 | 13 | 65 | 66 | 12 | 11 | 67 | 68 | \10 | 9 | 69 | 70 | \8 | \7 | 71 | 72 | \6 | 5 | 73 | 74 | TQFP 0.5mm | \4 | \3 | 76 | 75 | 2 | 1 | 78 | 80 | 82 | 84 | 86 | 88 | 90 | 92 | 94 | 96 | 98 | 100 | 77 | 79 | 81 | 83 | 85 | 87 | 89 | 91 | 93 | 95 | 97 | 99
bPlace: 47 | 45 | 43 | 41 | 39 | 37 | 35 | 33 | 48 | 46 | 44 | 42 | 40 | 38 | 36 | 34 | 49 | 50 | 32 | 31 | 51 | 52 | 30 | 29 | 53 | 54 | 28 | 27 | 55 | 56 | 26 | 25 | 24 | 23 | 57 | 58 | 59 | 60 | 22 | 21 | 61 | 62 | 20 | 19 | 63 | 64 | 18 | 17 | TQFP 0.8mm | 2 | \4 | \6 | \8 | \10 | 12 | 14 | 16 | 1 | \3 | 5 | \7 | 9 | 11 | 13 | 15